# Altium schematic sheet 13-JLINK_2.SchDoc
size 431 x 279 mm; Organization: ORGANIZATION; Address1: ADDRESS 1; Address2: ADDRESS 2; Address3: ADDRESS 3; Address4: ADDRESS 4; DocumentNumber: 13; Revision: -; SheetNumber: 13; SheetTotal: 14; ENG_APP_DATE: --/--/--; DSN_APP_DATE: --/--/--; CHK_APP_DATE: --/--/--
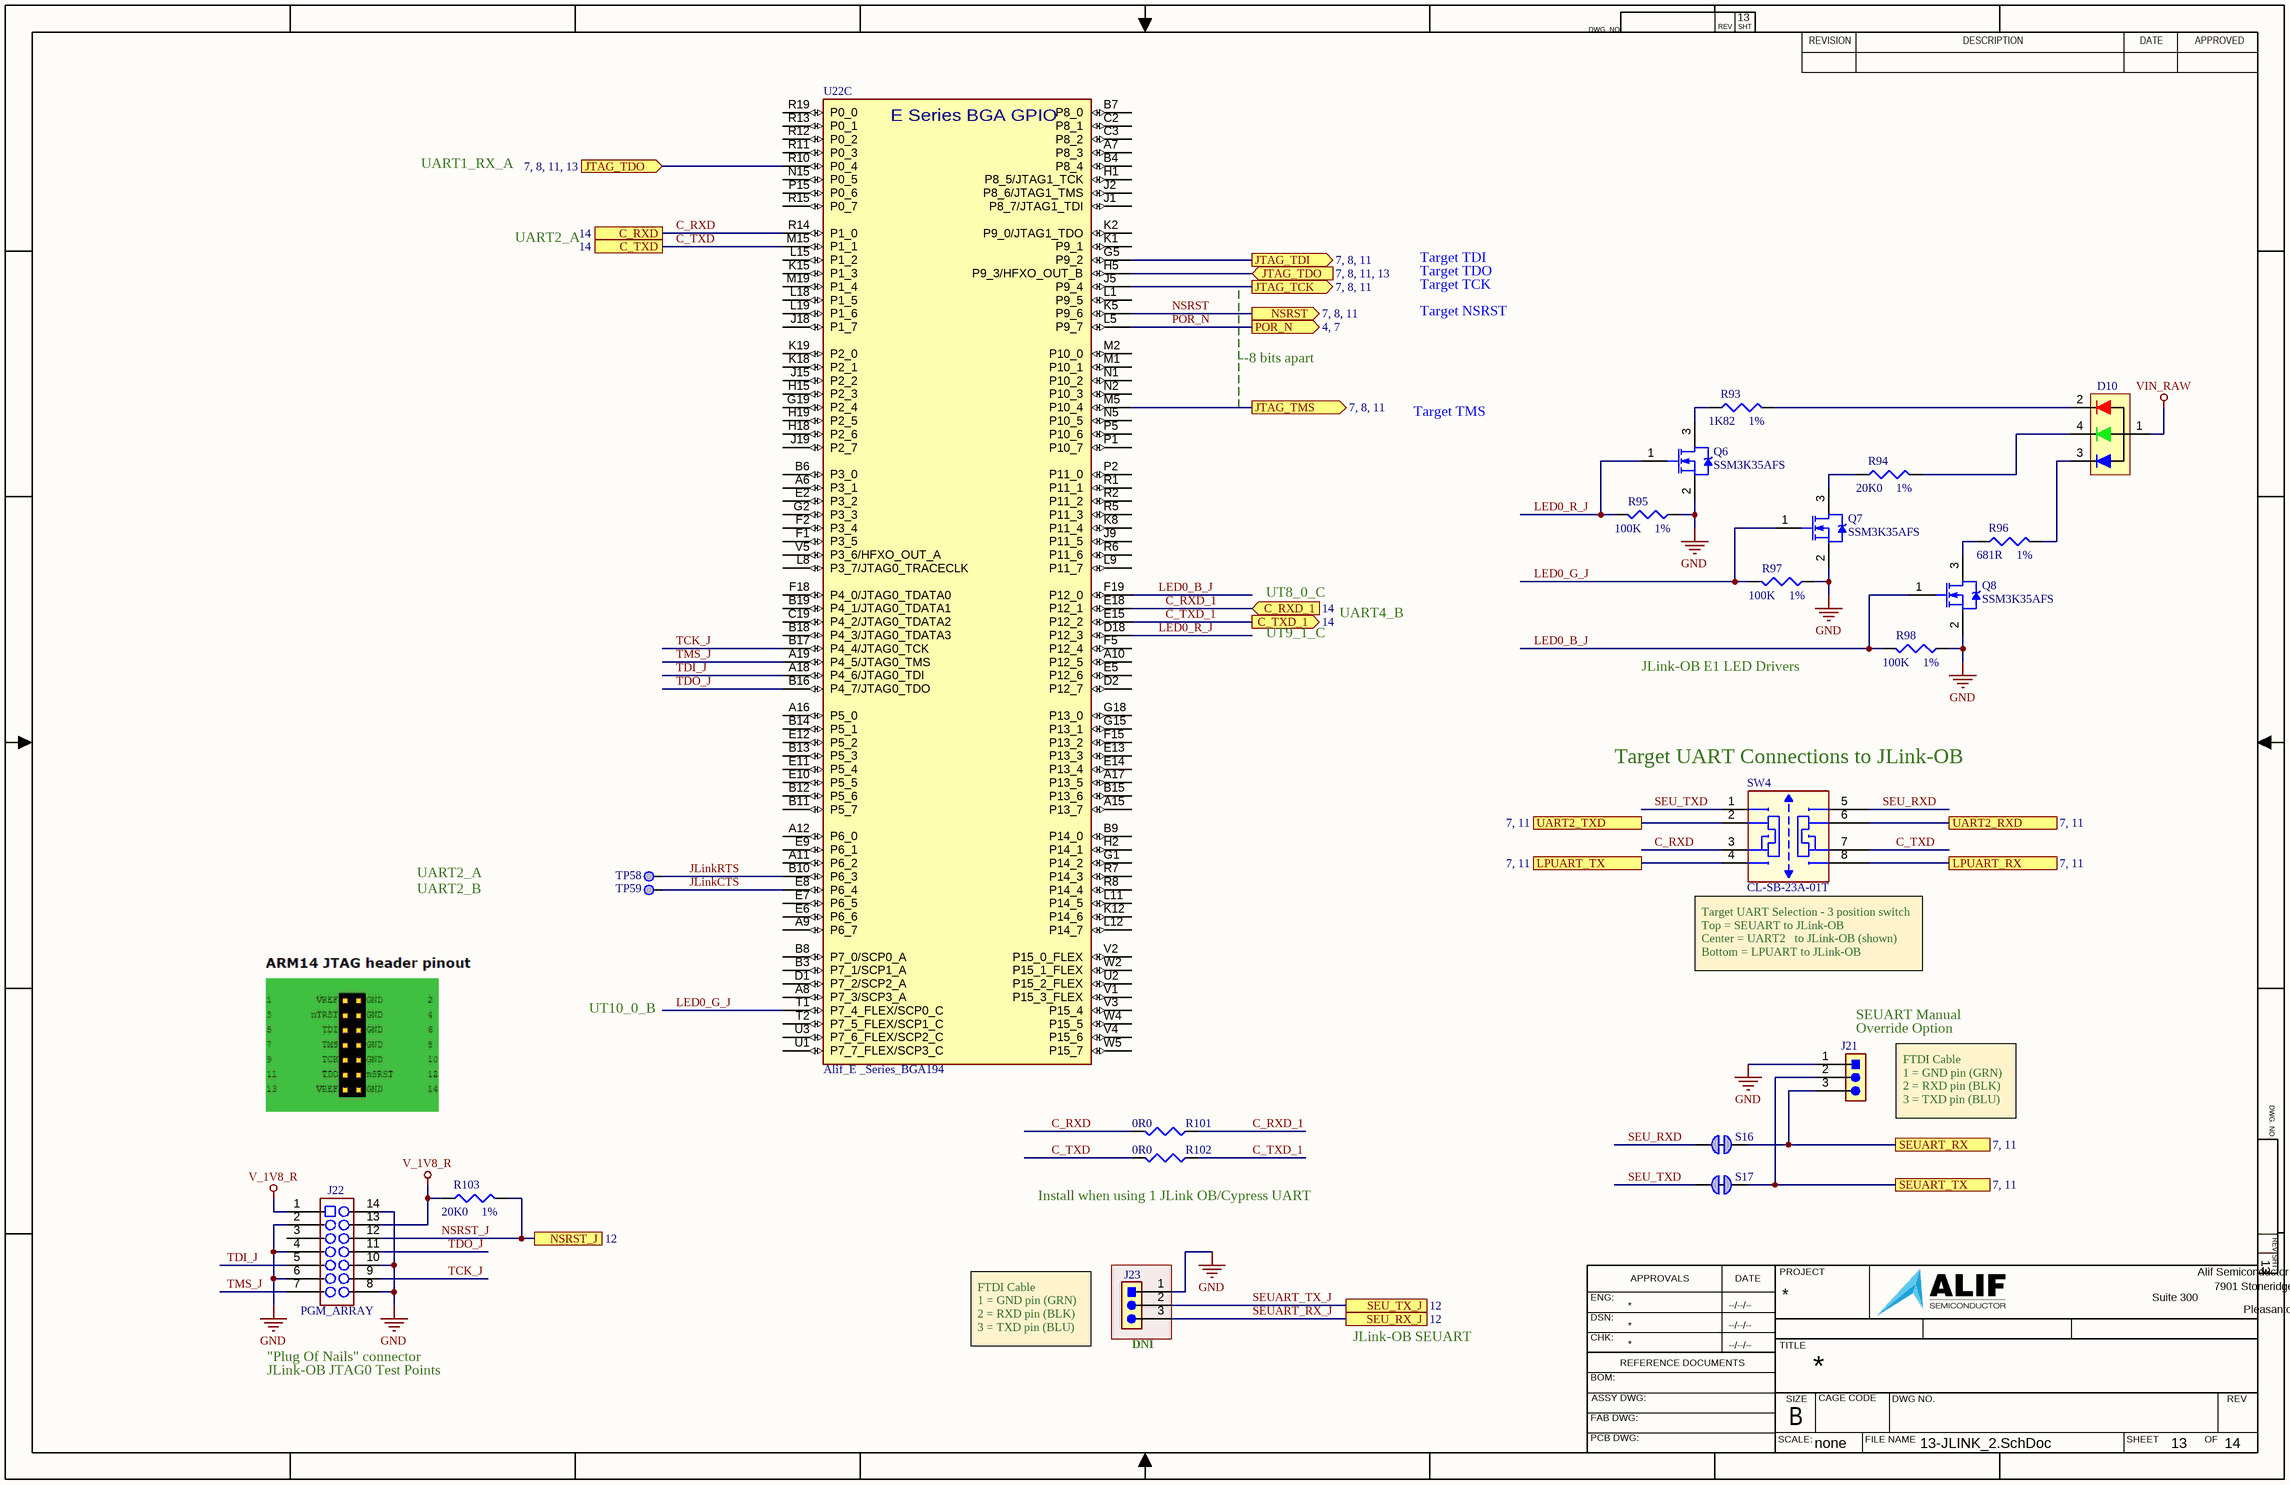
[diagram p0: 13-JLINK_2.SchDoc]

## Parts
D10  SML-LX0404SIUPGUSB  [LED_SML-LX0404_LUM]  (value not drawn)
J21  TSW-103-07-G-S  [CONN_HDR_1X3_STRT_0.100_no3D]  (value not drawn)
J22  value PGM_ARRAY  [TC2070-IDC]  (hidden comment: PGMG_CONTACT,14P,TC2070-IDC_1)  (no BOM)
J23  TSW-103-07-G-S  [CONN_HDR_1X3_STRT_0.100_no3D]  (value not drawn)
Q6  Manufacturer Part Number 1: SSM3K35AFS  [SC75_SSM_TOS-L]  (hidden comment: NMOS-2_SOT)
Q7  Manufacturer Part Number 1: SSM3K35AFS  [SC75_SSM_TOS-L]  (hidden comment: NMOS-2_SOT)
Q8  Manufacturer Part Number 1: SSM3K35AFS  [SC75_SSM_TOS-L]  (hidden comment: NMOS-2_SOT)
R93  value 1K82  Tolerance: 1%  [RESC0402-01]  (hidden comment: Res3)
R94  value 20K0  Tolerance: 1%  [RESC0402-01]  (hidden comment: Res3)
R95  value 100K  Tolerance: 1%  [RESC0402-01]  (hidden comment: Res3)
R96  value 681R  Tolerance: 1%  [RESC0402-01]  (hidden comment: Res3)
R97  value 100K  Tolerance: 1%  [RESC0402-01]  (hidden comment: Res3)
R98  value 100K  Tolerance: 1%  [RESC0402-01]  (hidden comment: Res3)
R101  value 0R0  [RESC0402-01]  (hidden comment: Res3)
R102  value 0R0  [RESC0402-01]  (hidden comment: Res3)
R103  value 20K0  Tolerance: 1%  [RESC0402-01]  (hidden comment: Res3)
S16  SolderJumperShorted_Small  [Solderbridge_Shorted]  (value not drawn)  (net tie, no BOM)
S17  SolderJumperShorted_Small  [Solderbridge_Shorted]  (value not drawn)  (net tie, no BOM)
SW4  CL-SB-23A-01T  [SW_CL-SB-23A-01_NDC-M]
TP58  TP_SMPAD  [TP_30_RND]  (value not drawn)  (no BOM)
TP59  TP_SMPAD  [TP_30_RND]  (value not drawn)  (no BOM)
U22  Alif_E _Series_BGA194  [BGA194 _CENTERED]  (part C of 4)

## Ports
C_RXD (see 14), C_RXD_1 (in, see 14), C_TXD (see 14), C_TXD_1 (out, see 14), JTAG_TCK (out, see 7, 8, 11), JTAG_TDI (out, see 7, 8, 11), JTAG_TDO (in, see 7, 8, 11, 13), JTAG_TMS (out, see 7, 8, 11), LPUART_RX (see 7, 11), LPUART_TX (see 7, 11), NSRST (out, see 7, 8, 11), NSRST_J (see 12), POR_N (out, see 4, 7), SEU_RX_J (see 12), SEU_TX_J (see 12), SEUART_RX (see 7, 11), SEUART_TX (see 7, 11), UART2_RXD (see 7, 11), UART2_TXD (see 7, 11)

## Nets
GND: J21.1 J22.2 J22.4 J22.6 J22.8 J22.10 J22.14 J23.1 Q6.2(S) Q7.2(S) Q8.2(S) R95.1 R97.1 R98.1
V_1V8_R: J22.1 J22.13 R103.1
VIN_RAW: D10.1(A)
C_RXD: R101.2 SW4.3(CA) U22.R14(P1_0) ; port C_RXD
C_RXD_1: R101.1 U22.E18(P12_1) ; port C_RXD_1
C_TXD: R102.2 SW4.7(2B) U22.M15(P1_1) ; port C_TXD
C_TXD_1: R102.1 U22.E15(P12_2) ; port C_TXD_1
JLinkCTS: TP59.1 U22.E8(P6_4)
JLinkRTS: TP58.1 U22.B10(P6_3)
JTAG_TCK: U22.J5(P9_4) ; port JTAG_TCK
JTAG_TDI: U22.G5(P9_2) ; port JTAG_TDI
JTAG_TDO: U22.H5(P9_3/HFXO_OUT_B) U22.R10(P0_4) ; port JTAG_TDO
JTAG_TMS: U22.M5(P10_4) ; port JTAG_TMS
LED0_B_J: Q8.1(G) R98.2 U22.F19(P12_0)
LED0_G_J: Q7.1(G) R97.2 U22.T1(P7_4_FLEX/SCP0_C)
LED0_R_J: Q6.1(G) R95.2 U22.D18(P12_3)
LPUART_RX: SW4.8(1B) ; port LPUART_RX
LPUART_TX: SW4.4(3A) ; port LPUART_TX
NSRST: U22.K5(P9_6) ; port NSRST
NSRST_J: J22.12 R103.2 ; port NSRST_J
POR_N: U22.L5(P9_7) ; port POR_N
SEU_RXD: S16.1 SW4.5(3B)
SEU_TXD: S17.1 SW4.1(1A)
SEUART_RX: J21.3 S16.2 ; port SEUART_RX
SEUART_RX_J: J23.3 ; port SEU_RX_J
SEUART_TX: J21.2 S17.2 ; port SEUART_TX
SEUART_TX_J: J23.2 ; port SEU_TX_J
TCK_J: J22.9 U22.B17(P4_4/JTAG0_TCK)
TDI_J: J22.5 U22.A18(P4_6/JTAG0_TDI)
TDO_J: J22.11 U22.B16(P4_7/JTAG0_TDO)
TMS_J: J22.7 U22.A19(P4_5/JTAG0_TMS)
UART2_RXD: SW4.6(CB) ; port UART2_RXD
UART2_TXD: SW4.2(2A) ; port UART2_TXD
NetD10_2: D10.2(RK) R93.2
NetD10_3: D10.3(BK) R96.2
NetD10_4: D10.4(GK) R94.2
NetQ6_3: Q6.3(D) R93.1
NetQ7_3: Q7.3(D) R94.1
NetQ8_3: Q8.3(D) R96.1

Not connected (* = marked no-connect by the designer): J22 3; U22 A6(P3_1) A7(P8_3) A8(P7_3/SCP3_A) A9(P6_7) A10(P12_5) A11(P6_2) A12(P6_0) A15(P13_7) A16(P5_0) A17(P13_5) B3(P7_1/SCP1_A) B4(P8_4) B6(P3_0) B7(P8_0) B8(P7_0/SCP0_A) B9(P14_0) B11(P5_7) B12(P5_6) B13(P5_3) B14(P5_1) B15(P13_6) B18(P4_3/JTAG0_TDATA3) B19(P4_1/JTAG0_TDATA1) C2(P8_1) C3(P8_2) C19(P4_2/JTAG0_TDATA2) D1(P7_2/SCP2_A) D2(P12_7) E2(P3_2) E5(P12_6) E6(P6_6) E7(P6_5) E9(P6_1) E10(P5_5) E11(P5_4) E12(P5_2) E13(P13_3) E14(P13_4) F1(P3_5) F2(P3_4) F5(P12_4) F15(P13_2) F18(P4_0/JTAG0_TDATA0) G1(P14_2) G2(P3_3) G15(P13_1) G18(P13_0) G19(P2_4) H1(P8_5/JTAG1_TCK) H2(P14_1) H15(P2_3) H18(P2_6) H19(P2_5) J1(P8_7/JTAG1_TDI) J2(P8_6/JTAG1_TMS) J9(P11_5) J15(P2_2) J18(P1_7) J19(P2_7) K1(P9_1) K2(P9_0/JTAG1_TDO) K8(P11_4) K12(P14_6) K15(P1_3) K18(P2_1) K19(P2_0) L1(P9_5) L8(P3_7/JTAG0_TRACECLK) L9(P11_7) L11(P14_5) L12(P14_7) L15(P1_2) L18(P1_5) L19(P1_6) M1(P10_1) M2(P10_0) M19(P1_4) N1(P10_2) N2(P10_3) N5(P10_5) N15(P0_5) P1(P10_7) P2(P11_0) P5(P10_6) P15(P0_6) R1(P11_1) R2(P11_2) R5(P11_3) R6(P11_6) R7(P14_3) R8(P14_4) R11(P0_3) R12(P0_2) R13(P0_1) R15(P0_7) R19(P0_0) T2(P7_5_FLEX/SCP1_C) U1(P7_7_FLEX/SCP3_C) U2(P15_2_FLEX) U3(P7_6_FLEX/SCP2_C) V1(P15_3_FLEX) V2(P15_0_FLEX) V3(P15_4) V4(P15_6) V5(P3_6/HFXO_OUT_A) W2(P15_1_FLEX) W4(P15_5) W5(P15_7)

## Notes on the sheet
- UART1_RX_A
- UART2_A
- Target TCK
- Target TDO
- Target TDI
- --8 bits apart
- Target NSRST
- Target TMS
- UT8_0_C
- UART4_B
- UT9_1_C
- JLink-OB E1 LED Drivers
- (near SW4) Target UART Connections to JLink-OB
- UART2_B
- (near SW4) Target UART Selection - 3 position switch
  Top = SEUART to JLink-OB
  Center = UART2   to JLink-OB (shown)
  Bottom = LPUART to JLink-OB
- UT10_0_B
- (near J21) SEUART Manual
- (near J21) Override Option
- FTDI Cable
  1 = GND pin (GRN)
  2 = RXD pin (BLK)
  3 = TXD pin (BLU)
- (near R102) Install when using 1 JLink OB/Cypress UART
- JLink-OB JTAG0 Test Points
- "Plug Of Nails" connector
- (near J23) DNI
- JLink-OB SEUART
- DWG. NO.
- REV
- SHT
- REVISION
- DESCRIPTION
- DATE
- APPROVED
- ENG:
- APPROVALS
- PROJECT
- Suite 300
- Alif Semiconductor
- 7901 Stoneridge Drive
- DSN:
- CHK:
- REFERENCE DOCUMENTS
- TITLE
- Pleasanton, CA 94588  USA
- BOM:
- FAB DWG:
- PCB DWG:
- ASSY DWG:
- SCALE:
- SIZE
- B
- CAGE CODE
- FILE NAME
- DWG NO.
- SHEET
- OF
- none
- (in symbol E7_B0_194BGA, part C) E Series BGA GPIO

## Library data of the parts
D10 = D LED_RGB_CA_1MMc1MM: Diode,LED,RGB, (@2mA) -> R=10mcd & 1.75V, G = 50mcd & 2.75V, B = 20mcd & 2.95V, 0404(1mm x 1mm); Manufacturer 1: Lumex; Published: 8-Jun-2000; LatestRevisionDate: 17-Jul-2002; LatestRevisionNote: Re-released for DXP Platform.; PackageVersion: Feb-2002; PackageReference: 1.0x1.0; Publisher: Altium Limited; PackageDescription: SM LED; 2 Flat Leads; Manufacturer Part Number 1: SML-LX0404SIUPGUSB; Manufacturer 2: *; Manufacturer Part Number 2: *; Manufacturer 3: *; Manufacturer Part Number 3: *
J21 = Hdr_M_1X3_2M54_STRT_UNSHROUD: Hdr, 0.025" SQ Post Header, Through-hole, Vertical, -55 to 125 degC, 2.54 mm Pitch, 3-Pin, Male, RoHS; Manufacturer: Samtec; Manufacturer Part Number 1: TSW-103-07-L-S; Pitch: 2.54 mm; ComponentLink3URL: http://www.samtec.com/documents/webfiles/cpdf/TSW-XXX-XX-XXX-X-XX-XXX-MKT.pdf; Temperature Range: -55 to 125 degC; DatasheetVersion: F-214; ComponentLink1Description: Manufacturer URL; ComponentLink2URL: http://www.samtec.com/documents/webfiles/pdf/TSW_TH.PDF; RoHS: True; Orientation: Vertical; ComponentLink2Description: Datasheet; ComponentLink3Description: Package Specification; PackageDescription: .025[0.64] SQ. Post Terminal Strip Assembly; Mounting Technology: Through-hole; PackageVersion: DM, 8/1988; ComponentLink1URL: http://www.samtec.com; PackageReference: *; PartNumber: *; Manufacturer 1: Samtec; Manufacturer 2: Sullins; Manufacturer Part Number 2: PRPC003SAAN-RC; Manufacturer 3: 3M; Manufacturer Part Number 3: 929647-01-03-I
J22 = PGMG_CONTACT,14P,TC2070-IDC_1: Test Point, Array, Alignment Pins, SMT Pad,--not a BOM item--; Manufacturer 1: *; Manufacturer Part Number 1: *; PCB_Footprint: TC2070-IDC
J23 = Hdr_M_1X3_2M54_STRT_UNSHROUD: DNI, Hdr, 0.025" SQ Post Header, Through-hole, Vertical, -55 to 125 degC, 2.54 mm Pitch, 3-Pin, Male, RoHS; Manufacturer: Samtec; Manufacturer Part Number 1: TSW-103-07-L-S; Pitch: 2.54 mm; ComponentLink3URL: http://www.samtec.com/documents/webfiles/cpdf/TSW-XXX-XX-XXX-X-XX-XXX-MKT.pdf; Temperature Range: -55 to 125 degC; DatasheetVersion: F-214; ComponentLink1Description: Manufacturer URL; ComponentLink2URL: http://www.samtec.com/documents/webfiles/pdf/TSW_TH.PDF; RoHS: True; Orientation: Vertical; ComponentLink2Description: Datasheet; ComponentLink3Description: Package Specification; PackageDescription: .025[0.64] SQ. Post Terminal Strip Assembly; Mounting Technology: Through-hole; PackageVersion: DM, 8/1988; ComponentLink1URL: http://www.samtec.com; PackageReference: *; PartNumber: *; Manufacturer 1: Samtec; Manufacturer 2: Sullins; Manufacturer Part Number 2: PRPC003SAAN-RC; Manufacturer 3: 3M; Manufacturer Part Number 3: 929647-01-03-I
Q6-Q8 = NMOS-2_SOT: MOSFET,N-CH,20V,250mA,1.1Ohm,SOT-23; Manufacturer 1: Toshiba; Note: Pin 2 is electrically connected to pin 4.; Value: 20V  180mA  2.4Ohm; Published: 8-Jun-2000; LatestRevisionDate: 17-Jul-2002; LatestRevisionNote: Re-released for DXP Platform.; DatasheetVersion: PD-9.814; PackageVersion: Feb-1997; PackageReference: TO-220AB; Publisher: Altium Limited; PackageDescription: TO, Thru-Hole, Vertical, Heatsink Mounted; 3 In-Line Leads; Pitch 2.54 mm; ComponentLink1Description: Manufacturer Link; ComponentLink1URL: http://www.irf.com/; Manufacturer 2: Rohm; Manufacturer Part Number 2: RUE002N02TL; Manufacturer 3: *; Manufacturer Part Number 3: *
R93 = Res3: Res,1K82,1%,100ppm,0402; Manufacturer 1: Stackpol; Manufacturer Part Number 1: RMCF0402FT1K82; Wattage: 63mW; Published: 8-Jun-2000; LatestRevisionDate: 29-May-2009; LatestRevisionNote: IPC-7351 Footprint Added.; PackageReference: RESC0402-01; Publisher: Altium Limited; PackageDescription: Chip Resistor; Voltage: *; Type: Thick Film; Manufacturer 2: Yageo; Manufacturer Part Number 2: RC0402FR-071K82L; Manufacturer 3: Bourns; Manufacturer Part Number 3: CR0402-FX-1821GLF; PCB_Footprint: RESC0402-01
R94 R103 = Res3: Res,20K0,1%,100ppm,0402; Manufacturer 1: Stackpol; Manufacturer Part Number 1: RMCF0402FT20K0; Wattage: 63mW; Published: 8-Jun-2000; LatestRevisionDate: 29-May-2009; LatestRevisionNote: IPC-7351 Footprint Added.; PackageReference: RESC0402-01; Publisher: Altium Limited; PackageDescription: Chip Resistor; Voltage: *; Type: Thick Film; Manufacturer 2: Yageo; Manufacturer Part Number 2: RC0402FR-0720KL; Manufacturer 3: Bourns; Manufacturer Part Number 3: CR0402-FX-2002GLF; PCB_Footprint: RESC0402-01
R95 R97 R98 = Res3: Res,100K,1%,100ppm,0402; Manufacturer 1: Stackpol; Manufacturer Part Number 1: RMCF0402FT100K; Wattage: 63mW; Published: 8-Jun-2000; LatestRevisionDate: 29-May-2009; LatestRevisionNote: IPC-7351 Footprint Added.; PackageReference: RESC0402-01; Publisher: Altium Limited; PackageDescription: Chip Resistor; Voltage: *; Type: Thick Film; Manufacturer 2: Yageo; Manufacturer Part Number 2: RC0402FR-07100KL; Manufacturer 3: Bourns; Manufacturer Part Number 3: CR0402-FX-1003GLF; PCB_Footprint: RESC0402-01
R96 = Res3: Res,681R,1%,100ppm,0402; Manufacturer 1: Stackpol; Manufacturer Part Number 1: RMCF0402FT681R; Wattage: 63mW; Published: 8-Jun-2000; LatestRevisionDate: 29-May-2009; LatestRevisionNote: IPC-7351 Footprint Added.; PackageReference: RESC0402-01; Publisher: Altium Limited; PackageDescription: Chip Resistor; Voltage: *; Type: Thick Film; Manufacturer 2: Yageo; Manufacturer Part Number 2: RC0402FR-07681RL; Manufacturer 3: Bourns; Manufacturer Part Number 3: CR0402-FX-6810GLF; PCB_Footprint: RESC0402-01
R101 R102 = Res3: Res,0R ohm,Jumper,0402; Manufacturer 1: Stackpol; Manufacturer Part Number 1: RMCF0402ZT0R00; Wattage: 63mW; Tolerance: JMPR; Published: 8-Jun-2000; LatestRevisionDate: 29-May-2009; LatestRevisionNote: IPC-7351 Footprint Added.; PackageReference: RESC0402-01; Publisher: Altium Limited; PackageDescription: Chip Resistor; Voltage: *; Type: Thick Film; Manufacturer 2: Yageo; Manufacturer Part Number 2: RC0402FR-070RL; Manufacturer 3: Panasonic; Manufacturer Part Number 3: ERJ-XGN0R00Y; PCB_Footprint: RESC0402-01
S16 S17 = SolderJumperShorted_Small: DNI,Solderable Jumper,Shorted; Wattage: 63mW; PCB_Footprint: SSHORTED; Published: 8-Jun-2000; LatestRevisionDate: 29-May-2009; LatestRevisionNote: IPC-7351 Footprint Added.; PackageReference: J1-0603; Publisher: Altium Limited; PackageDescription: Chip Resistor; Voltage: *; Type: Thick Film; Manufacturer 1: *; Manufacturer Part Number 1: *; Manufacturer 2: *; Manufacturer Part Number 2: *; Manufacturer 3: *; Manufacturer Part Number 3: *; Tolerance: *; Value: *
SW4 = SW_DP3T_CL-SB-23A-01T: Switch, DP3T Slide,8-pin, Vertical, 13mm x 3.6mm x 3.5mm, Actuator 2mm , Tin Contacts,JLead SMT; Manufacturer 1: C&K; Manufacturer Part Number 1: JS203011JCQN; Manufacturer 2: Nidec; Manufacturer Part Number 2: CL-SB-23A-01T
TP58 TP59 = TP_SMPAD: Test Point, SMT Pad,--not a BOM item--; PCB_Footprint: TP_PAD1
U22 = E7_B0_194BGA: IC,Alif E1 MCU, Rev B silicon,BGA194; Manufacturer 1: Alif Semi; Manufacturer Part Number 1: AE101F4071542LH